# EAGLE design maul3 (EAGLE 7.4.0)
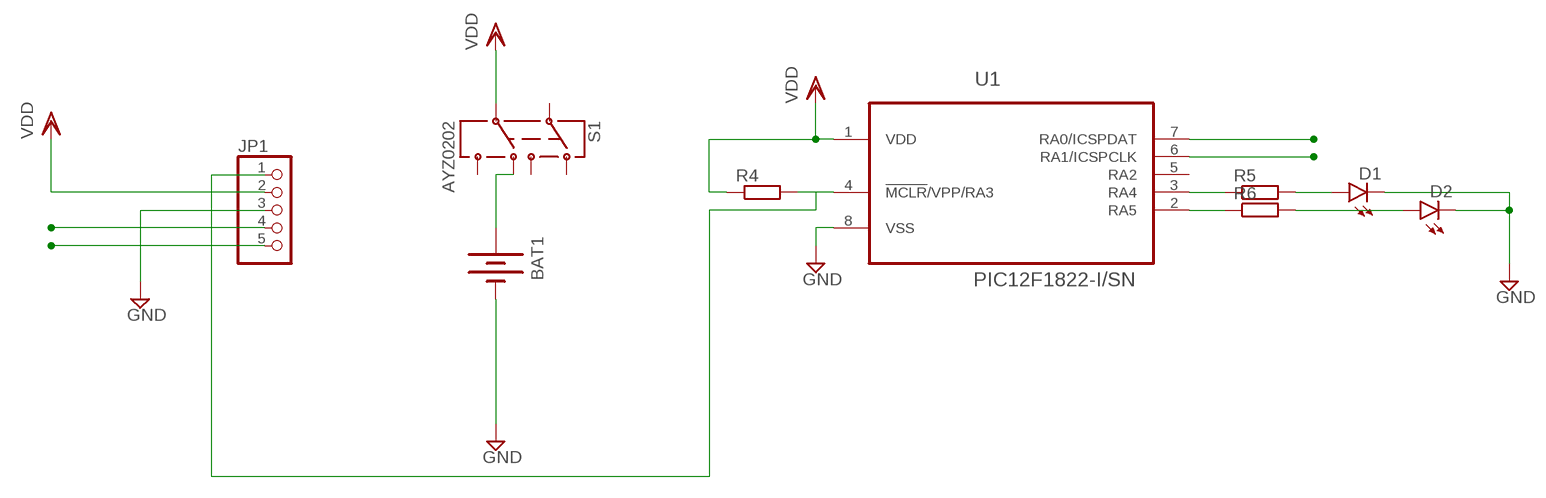
[diagram p0: schematic, sheet 1]

## Parts
BAT1  BATTERYFOB  [BATTERY_20MM_PTH_COMPACT]
D1  LED1206  [LED-1206]
D2  LED1206  [LED-1206]
JP1  PINHD-1X5  [1X05]
R4  R-EU_R1206  [R1206]
R5  R-EU_R1206  [R1206]
R6  R-EU_R1206  [R1206]
S1  AYZ0202  [AYZ0202]
U1  PIC12F1822-I/SN  [SOIC127P600X175-8N]

## Nets
GND: BAT1.2(-) D1.C D2.C JP1.3 U1.8(VSS)
ICSPCLK: JP1.5 U1.6(RA1/ICSPCLK)
ICSPDAT: JP1.4 U1.7(RA0/ICSPDAT)
N$1: BAT1.1(+) S1.6
N$4: R6.1 U1.2(RA5)
N$5: R5.1 U1.3(RA4)
N$6: D2.A R6.2
N$7: D1.A R5.2
VDD: JP1.2 R4.1 S1.5 U1.1(VDD)
VPP: JP1.1 R4.2 U1.4(!MCLR!/VPP/RA3)
Unconnected: S1.1 S1.2 S1.3 S1.4 U1.5(RA2)

## Library data of the parts
BAT1 = SparkFun-Electromechanical:BATTERY: Battery Holders Various common sizes : AA, AAA, 18650 (PRT-12895), 20mm coin cell and 12mm coin cell. 20MM_4LEGS, BATT-10373
D1 D2 = SparkFun-LED:LED: LEDs Standard schematic elements and footprints for 5mm, 3mm, 1206, and 0603 sized LEDs. 5mm - Spark Fun Electronics SKU : COM-00529 (and others)
JP1 = pinhead:PINHD-1X5: PIN HEADER
R4-R6 = resistor:R-EU_: RESISTOR, European symbol
S1 = SparkFun-Electromechanical:AYZ0202: SPDT Slide Switch Simple SMD single-pull double-throw slide switch. Good for less than 350mA power switch, switching UARTs between devices, etc. Spark Fun Electronics SKU : COM-00597; PROD_ID: SWCH-08179
U1 = PIC12F1822ISN:PIC12F1822-I/SN: IC, MCU, 8BIT, 3.5K FLASH, 8SOIC; MPN: PIC12F1822-I/SN; OC_FARNELL: 1971857; OC_NEWARK: 53R0197; PACKAGE: SOIC-8; SUPPLIER: Microchip

## Board
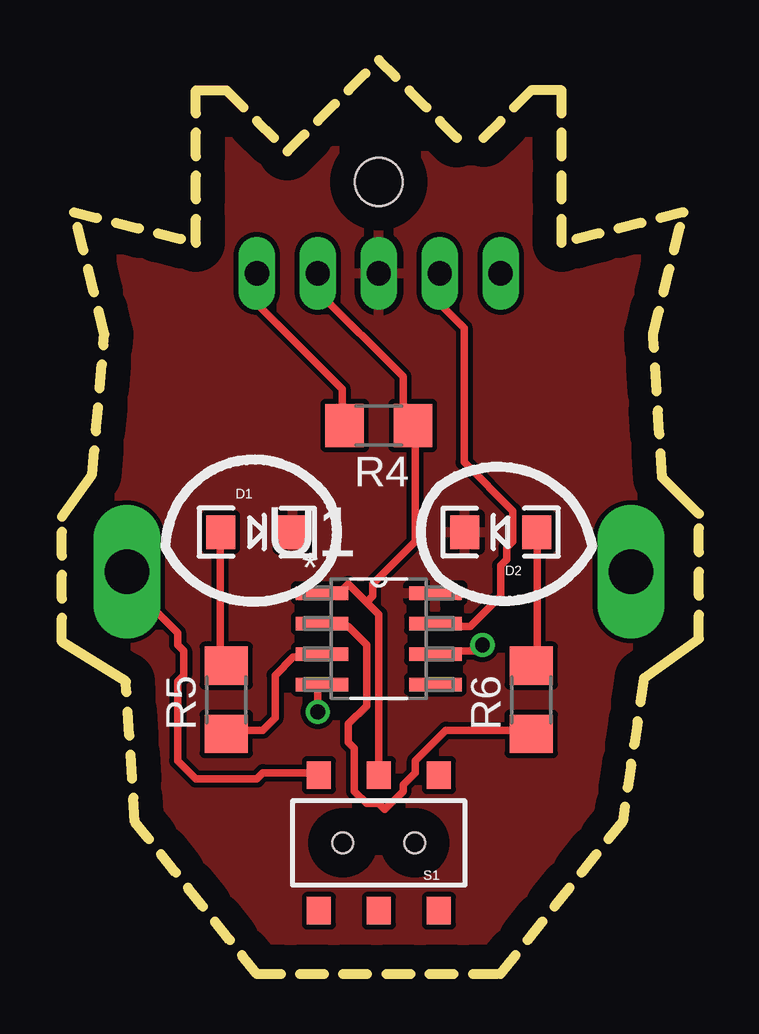
[diagram p1: board, top side]
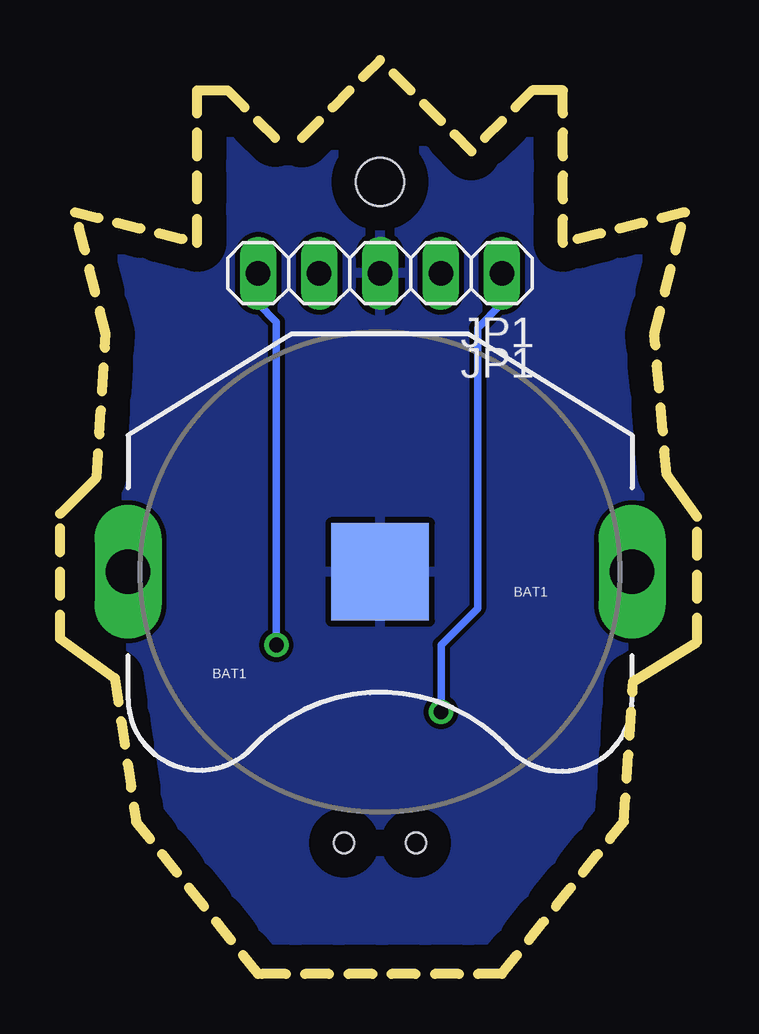
[diagram p2: board, bottom side, seen from below]

Size 26.54 x 38.1 mm. Coordinates in mm from the lower left corner, seen from the top.
Outline: 25.91,31.75 20.83,30.48 20.83,36.83 19.56,36.83 17.02,34.29 13.21,38.1 9.4,34.29 6.86,36.83 5.59,36.83 5.59,30.48 0.51,31.75 1.78,26.67 1.27,20.83 0,19.05 0,13.84 2.67,12.19 3.05,6.35 8.13,0 18.29,0 23.37,6.35 24.26,12.32 26.54,13.97 26.54,19.18 25.02,20.7 24.64,26.67 25.91,31.75
Copper layers (1*16): Top 0.035mm / dielectric 1.5mm / Bottom 0.035mm
Design rules "default *": minimum track width 12mil, minimum drill 24mil, track to track 8mil, track to pad 8mil, pad to pad 8mil, via to via 8mil, smd to smd 8mil, copper to edge 40mil, drill to drill 8mil, minimum pad ring 10mil, minimum via ring 8mil, stop-mask expansion 4mil, vias tented up to drill 0mil, thermal gap 10mil
Holes 2 mm at 13.21,33.02

### Footprints (pad centres in the part's own frame; a part is rotated, then mirrored left to right if it is on the bottom)
BATTERY_20MM_PTH_COMPACT = drill 1.854 long: 1 -10.5,0; 3 10.5,0 | smd 4.064 x 4.064: 2 0,0
LED-1206 = smd 1.2 x 1.4: A -1.5,0; C 1.5,0
1X05 = drill 1.016 long: 1 -5.08,0; 2 -2.54,0; 3 0,0; 4 2.54,0; 5 5.08,0
R1206 = smd 1.6 x 1.803: 1 -1.422,0; 2 1.422,0
AYZ0202 = smd 1 x 1.15: 1 -2.5,2.825; 2 0,2.825; 3 2.5,2.825; 4 -2.5,-2.825; 5 0,-2.825; 6 2.5,-2.825 | hole 0.85: 1.5,0; -1.5,0
SOIC127P600X175-8N = smd 2.184 x 0.559: 1 -2.362,1.905; 2 -2.362,0.635; 3 -2.362,-0.635; 4 -2.362,-1.905; 5 2.362,-1.905; 6 2.362,-0.635; 7 2.362,0.635; 8 2.362,1.905

### Placement (x,y rotation side)
BAT1  13.21,16.76 180 bottom
D1  8.13,18.42 0 top
D2  18.29,18.42 180 top
JP1  13.21,29.21 180 bottom
R4  13.21,22.86 180 top
R5  6.86,11.43 90 top
R6  19.56,11.43 90 top
S1  13.21,5.46 180 top
U1  13.21,13.97 0 top

### Tracks (layer width: path | path; a pad name or v marks a point on that pad's centre or on a via)
GND
  pour Top: -0.76,-1.27 27.18,-1.27 27.18,38.1 -0.76,38.1
  pour Bottom: 27.18,-1.27 -0.76,-1.27 -0.76,38.1 27.18,38.1
ICSPCLK  (via drill 0.61)
  Top 0.305: v17.53,13.72 17.27,13.46 15.75,13.46 U1.6
  Bottom 0.305: v17.53,13.72 17.53,27.18 18.29,27.94 JP1.5
ICSPDAT
  Top 0.305: JP1.4 15.75,27.94 16.76,26.92 16.76,21.34 18.8,19.3 18.8,18.03 18.54,17.78 18.54,17.27 18.29,17.02 18.29,15.75 17.02,14.48 15.75,14.48 U1.7
N$1
  Top 0.305: S1.6 10.67,8.38 8.38,8.38 8.13,8.13 5.59,8.13 4.83,8.89 4.83,12.19 5.08,12.45 5.08,13.46 4.83,13.72 4.83,14.22 2.79,16.26 2.79,16.76 BAT1.1
N$4
  Top 0.305: R6.1 19.56,10.16 16,10.16 14.73,8.89 14.73,8.38 14.22,7.87 14.22,7.62 13.46,6.86 13.21,7.11 12.7,7.11 12.19,7.62 12.19,9.4 11.94,9.65 11.94,10.41 12.7,11.18 12.7,13.72 11.94,14.48 10.92,14.48 U1.2
N$5
  Top 0.305: R5.1 6.86,10.16 8.38,10.16 8.89,10.67 8.89,12.45 9.65,13.21 10.67,13.21 U1.3
N$6
  Top 0.305: D2.A 19.81,18.29 19.81,13.21 19.56,12.95 R6.2
N$7
  Top 0.305: D1.A 6.6,18.29 6.6,13.21 6.86,12.95 R5.2
VDD
  Top 0.305: S1.5 13.21,14.99 12.7,15.49 | 12.7,15.49 11.94,16.26 11.43,15.75 10.92,15.75 U1.1 | 12.7,15.49 12.95,15.75 12.95,16.26 14.73,18.03 14.73,22.86 R4.1 14.48,22.86 14.22,23.11 14.22,24.89 10.67,28.45 JP1.2
VPP  (via drill 0.61)
  Top 0.305: JP1.1 8.13,27.94 11.68,24.38 11.68,22.86 R4.2 | v10.67,10.92 10.67,11.94 U1.4
  Bottom 0.305: v10.67,10.92 10.67,13.72 9.14,15.24 9.14,26.92 8.13,27.94 JP1.1

### Text on the board
_tNames: R4 | D1 | U1 | D2 | R5 | R6 | S1
_bNames: JP1 | BAT1